# Altium project theremin.PrjPcb
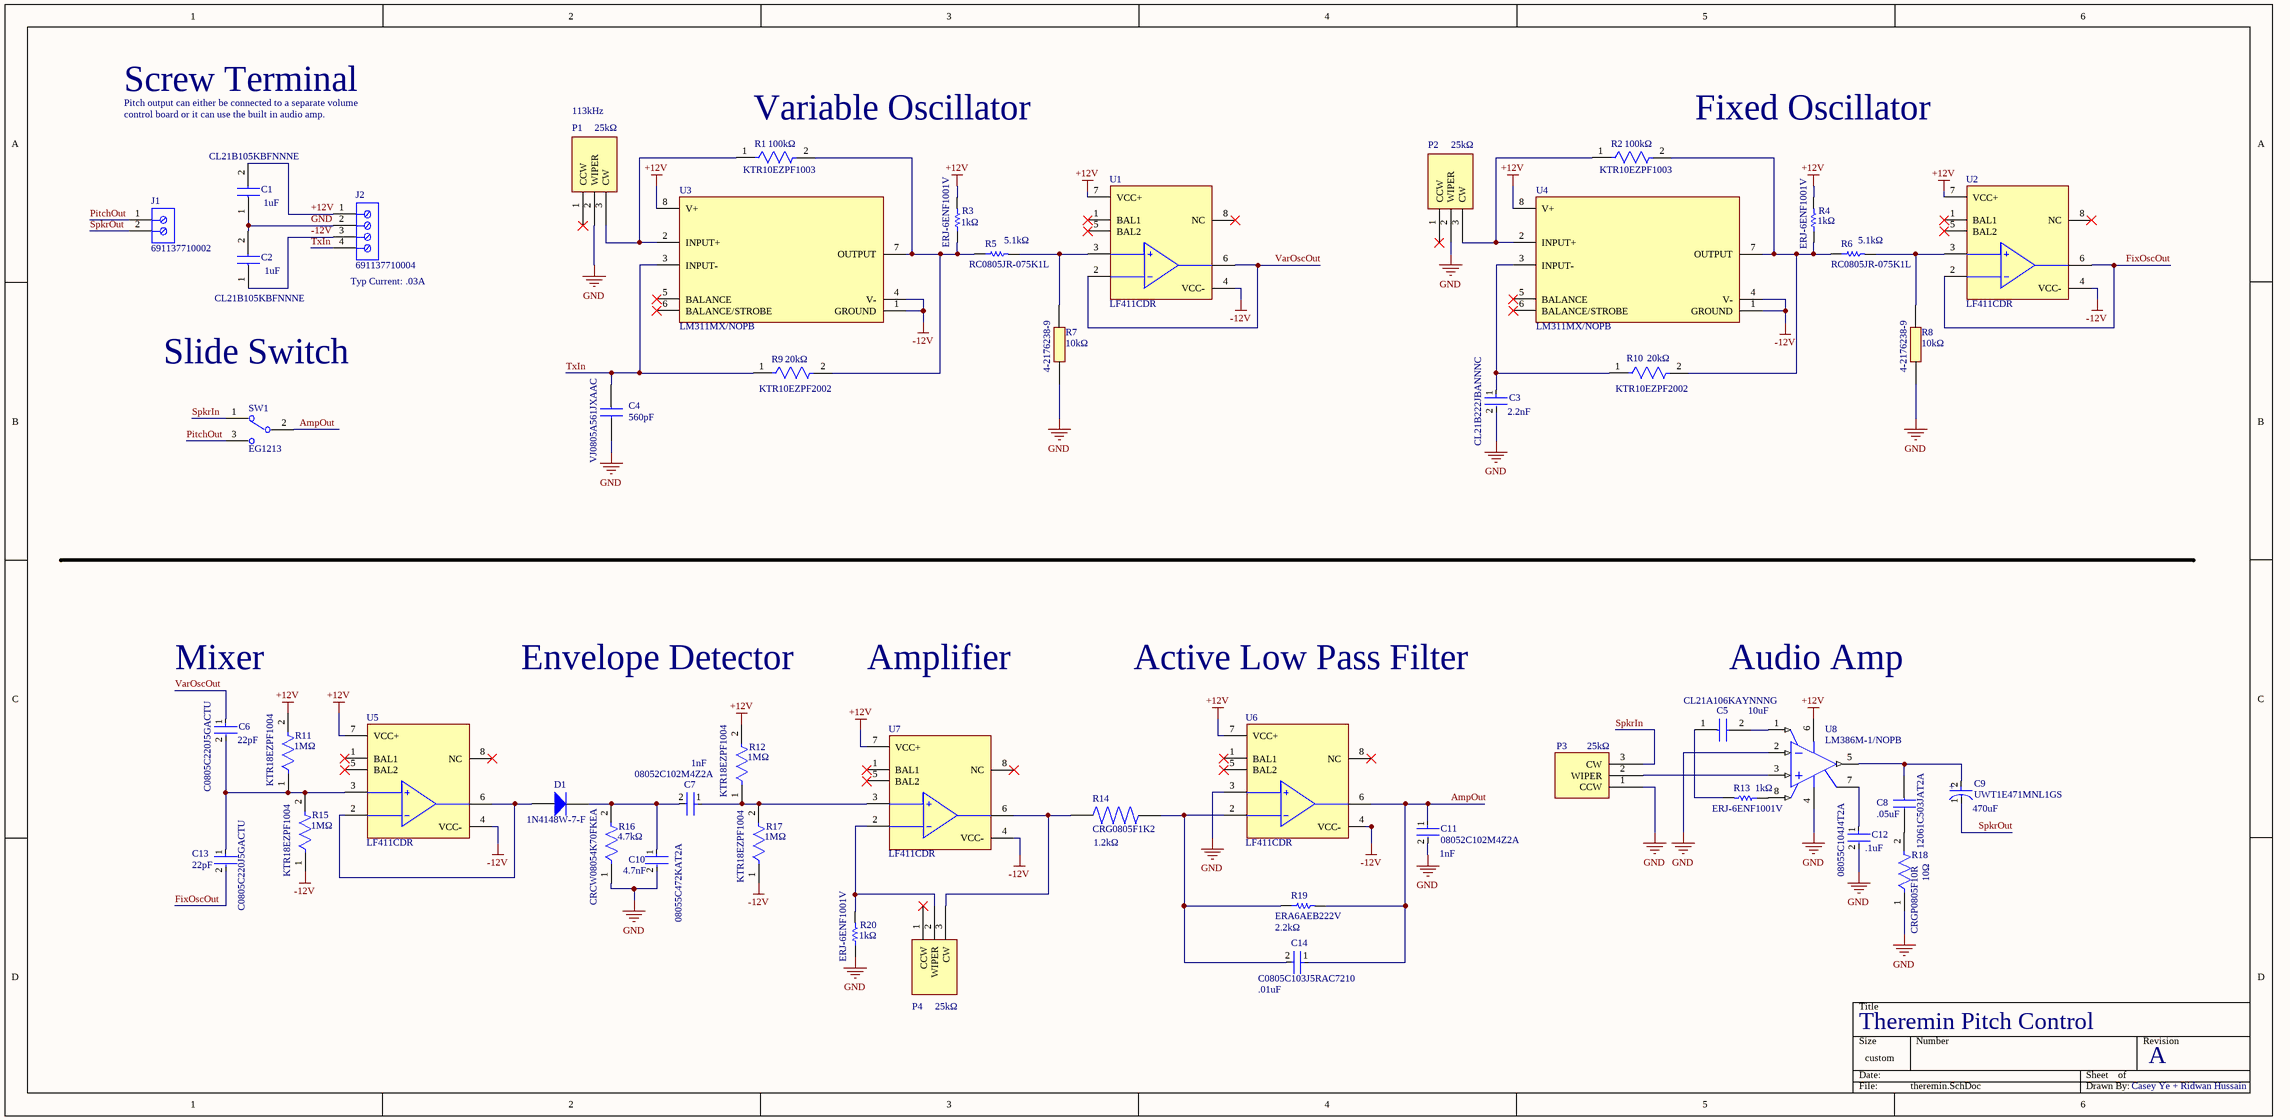
[diagram p0: theremin.SchDoc]
1 sheet, 50 parts. Net scope: global (net labels, ports and power ports of the same name join across sheets).
Board files: theremin.PcbDoc, theremin2.PcbDoc

## Sheet theremin.SchDoc
size 508 x 248 mm

### Parts
C1  CL21B105KBFNNNE  [CAPC2012X135N]
C2  CL21B105KBFNNNE  [CAPC2012X135N]
C3  CL21B222JBANNNC  [FP-CL21-IPC_B]
C4  VJ0805A561JXAAC  [CAPC2012X145N]
C5  CL21A106KAYNNNG  [CAPC2012X145N]
C6  C0805C220J5GACTU  [FP-C0805C-DN-MFG]
C7  08052C102M4Z2A  [FP-0805-L_2_01_0_2-W_1_25-IPC_B]
C8  12061C503JAT2A  [CAPC3216X94N]  (value not drawn)
C9  UWT1E471MNL1GS  [FP-UWT1E471MNL1GS-MFG]
C10  08055C472KAT2A  [FP-0805-L_2_01_0_2-W_1_25-IPC_B]
C11  08052C102M4Z2A  [FP-0805-L_2_01_0_2-W_1_25-IPC_B]
C12  08055C104J4T2A  [FP-0805-L_2_01_0_2-W_1_25-MFG]
C13  C0805C220J5GACTU  [FP-C0805C-DN-MFG]
C14  C0805C103J5RAC7210  [FP-C0805C-DN-MFG]
D1  1N4148W-7-F  [DIOD-SOD123-2_V]
J1  691137710002  [691137710002]
J2  691137710004  [691137710004]
P1  25kOhmPotentiometer  [25kOhmPotentiometer-Footprint-1]  (value not drawn)
P2  25kOhmPotentiometer  [25kOhmPotentiometer-Footprint-1]  (value not drawn)
P3  25kOhmPotentiometer  [25kOhmPotentiometer-Footprint-1]  (value not drawn)
P4  25kOhmPotentiometer  [25kOhmPotentiometer-Footprint-1]  (value not drawn)
R1  KTR10EZPF1003  [FP-KTR10-MFG]
R2  KTR10EZPF1003  [FP-KTR10-MFG]
R3  ERJ-6ENF1001V  [RESC2013X70X40ML20T20]
R4  ERJ-6ENF1001V  [RESC2013X70X40ML20T20]
R5  RC0805JR-075K1L  [RESC2013X60X35ML10T20]
R6  RC0805JR-075K1L  [RESC2013X60X35ML10T20]
R7  4-2176238-9  [RESC2012X65N]
R8  4-2176238-9  [RESC2012X65N]
R9  KTR10EZPF2002  [FP-KTR10-IPC_C]
R10  KTR10EZPF2002  [FP-KTR10-IPC_C]
R11  KTR18EZPF1004  [FP-KTR18-IPC_C]
R12  KTR18EZPF1004  [FP-KTR18-IPC_C]
R13  ERJ-6ENF1001V  [RESC2013X70X40ML20T20]
R14  CRG0805F1K2  [RESC2012X65N]
R15  KTR18EZPF1004  [FP-KTR18-IPC_C]
R16  CRCW08054K70FKEA  [FP-CRCW0805-e3-IPC_B]
R17  KTR18EZPF1004  [FP-KTR18-IPC_C]
R18  CRGP0805F10R  [FP-CRGP0805-IPC_C]
R19  ERA6AEB222V  [RESC2013X60X40LL20T25]
R20  ERJ-6ENF1001V  [RESC2013X70X40ML20T20]
SW1  EG1213  [SW_EG1213]
U1  LF411CDR  [FP-D0008A-IPC_A]
U2  LF411CDR  [FP-D0008A-IPC_A]
U3  LM311MX/NOPB  [FP-D0008A-IPC_A]
U4  LM311MX/NOPB  [FP-D0008A-IPC_A]
U5  LF411CDR  [FP-D0008A-IPC_A]
U6  LF411CDR  [FP-D0008A-IPC_A]
U7  LF411CDR  [FP-D0008A-IPC_A]
U8  LM386M-1/NOPB  [TI-D8_M]

### Nets
+12V: C1.2 J2.1 R3.2 R4.2 R11.2 R12.2 U1.7(VCC+) U2.7(VCC+) U3.8(V+) U4.8(V+) U5.7(VCC+) U6.7(VCC+) U7.7(VCC+) U8.6(VS)
-12V: C2.1 J2.3 R15.1 R17.1 U1.4(VCC-) U2.4(VCC-) U3.1(GROUND) U3.4(V-) U4.1(GROUND) U4.4(V-) U5.4(VCC-) U6.4(VCC-) U7.4(VCC-)
GND: C1.1 C2.2 C3.2 C4.1 C10.2 C11.2 C12.2 J2.2 P1.2(WIPER) P2.2(WIPER) P3.1(CCW) R7.1 R8.1 R16.1 R18.1 R20.1 U6.3(IN+) U8.2(IN-) U8.4(GND)
AmpOut: C11.1 C14.1 R19.2 SW1.2 U6.6(OUT)
FixOscOut: C13.2 U2.2(IN-) U2.6(OUT)
PitchOut: J1.1 SW1.3
SpkrIn: P3.3(CW) SW1.1
SpkrOut: C9.1(C) J1.2
TxIn: C4.2 J2.4 R9.1 U3.3(INPUT-)
VarOscOut: C6.1 U1.2(IN-) U1.6(OUT)
NetC3_1: C3.1 R10.1 U4.3(INPUT-)
NetC5_1: C5.1 R13.2
NetC5_2: C5.2 U8.1(GAIN)
NetC6_2: C6.2 C13.1 R11.1 R15.2 U5.3(IN+)
NetC7_1: C7.1 R12.1 R17.2 U7.3(IN+)
NetC7_2: C7.2 C10.1 D1.2(K) R16.2
NetC8_1: C8.1 R18.2
NetC8_2: C8.2 C9.2(A) U8.5(VOUT)
NetC12_1: C12.1 U8.7(BYPASS)
NetC14_2: C14.2 R14.2 R19.1 U6.2(IN-)
NetD1_1: D1.1(A) U5.2(IN-) U5.6(OUT)
NetP1_3: P1.3(CW) R1.1 U3.2(INPUT+)
NetP2_3: P2.3(CW) R2.1 U4.2(INPUT+)
NetP3_2: P3.2(WIPER) U8.3(IN+)
NetP4_2: P4.2(WIPER) R20.2 U7.2(IN-)
NetP4_3: P4.3(CW) R14.1 U7.6(OUT)
NetR1_2: R1.2 R3.1 R5.1 R9.2 U3.7(OUTPUT)
NetR2_2: R2.2 R4.1 R6.1 R10.2 U4.7(OUTPUT)
NetR5_2: R5.2 R7.2 U1.3(IN+)
NetR6_2: R6.2 R8.2 U2.3(IN+)
NetR13_1: R13.1 U8.8(GAIN)

Not connected (* = marked no-connect by the designer): P1 1(CCW)*; P2 1(CCW)*; P4 1(CCW)*; U1 1(BAL1)* 5(BAL2)* 8(NC)*; U2 1(BAL1)* 5(BAL2)* 8(NC)*; U3 5(BALANCE)* 6(BALANCE/STROBE)*; U4 5(BALANCE)* 6(BALANCE/STROBE)*; U5 1(BAL1)* 5(BAL2)* 8(NC)*; U6 1(BAL1)* 5(BAL2)* 8(NC)*; U7 1(BAL1)* 5(BAL2)* 8(NC)*

### Notes on the sheet
- Screw Terminal
- 113kHz
- Pitch output can either be connected to a separate volume control board or it can use the built in audio amp.
- 25kΩ
- (near R1) Variable Oscillator
- (near R1) 100kΩ
- (near R2) 100kΩ
- Fixed Oscillator
- (near C1) 1uF
- (near R3) 1kΩ
- (near R4) 1kΩ
- (near C2) 1uF
- (near J2) Typ Current: .03A
- (near R5) 5.1kΩ
- (near R6) 5.1kΩ
- (near R7) 10kΩ
- (near R8) 10kΩ
- Slide Switch
- (near R9) 20kΩ
- (near R10) 20kΩ
- (near C4) 560pF
- (near C3) 2.2nF
- Mixer
- Envelope Detector
- Amplifier
- Active Low Pass Filter
- Audio Amp
- 10uF
- (near C6) 22pF
- (near R11) 1MΩ
- 1nF
- (near R12) 1MΩ
- (near P3) 25kΩ
- (near R13) 1kΩ
- (near R15) 1MΩ
- (near R16) 4.7kΩ
- (near R17) 1MΩ
- (near R14) 1.2kΩ
- (near C12) .1uF
- (near C8) .05uF
- 12061C503JAT2A
- (near C9) 470uF
- (near C13) 22pF
- 4.7nF
- (near C11) 1nF
- (near R18) 10Ω
- (near R20) 1kΩ
- 2.2kΩ
- (near C14) .01uF
- Theremin Pitch Control
- A
- Casey Ye + Ridwan Hussain
- (in symbol CMP-12462-000037-1) +

### Library data of the parts
C1 C2 = CL21B105KBFNNNE: Capacitor; Manufacturer_Name: SAMSUNG; Datasheet Link: https://componentsearchengine.com/Datasheets/2/CL21B105KBFNNNE.pdf; Height: 1.35mm; Manufacturer_Part_Number: CL21B105KBFNNNE; Mouser Part Number: 187-CL21B105KBFNNNE; Mouser Price/Stock: https://www.mouser.co.uk/ProductDetail/Samsung-Electro-Mechanics/CL21B105KBFNNNE?qs=yOVawPpwOwmddQEBPU6Y9A%3D%3D; Arrow Part Number: CL21B105KBFNNNE; Arrow Price/Stock: https://www.arrow.com/en/products/cl21b105kbfnnne/samsung-electro-mechanics?region=europe
C3 = CMP-13271-000077-1: CL21 Series 0805 2.2nF 50V ±5% Tolerance X7R Multilayer Ceramic Chip Capacitor; Voltage Rating: 50V; Case/Package: 0805; Voltage Rating (DC): 50V; Dielectric: X7R; Lead Free: Lead Free; Max Operating Temperature: 125°C; Width: 0.049inch; Case Code (Imperial): 0805; Case Code (Metric): 2012; Tolerance: 5%; Length: 2mm; Mount: Surface Mount; Contact Plating: Tin; Voltage: 50V; Height: 0.65mm; Package Quantity: 4000; Thickness: 0.03inch; Depth: 1.25mm; Min Operating Temperature: -55°C; Radiation Hardening: No; Capacitance: 2.2nF; Packaging: Tape and Reel
C4 = CMP-030-000000-1: VISHAY - VJ0805A561JXAAC - CAP, 560PF, 50V, 5%, C0G/NP0, 0805; Geometry.Height: 1.45mm; Manufacturer_Name: Vishay; Source: VJ0805A561JXAAC.SchLib; Mouser Part Number: 77-VJ0805A561JXAAC; Design Item ID: VJ0805A561JXAAC; Datasheet Link: http://www.vishay.com/docs/45226/vj31xrohsautomlcc.pdf; Mouser Price/Stock: https://www.mouser.co.uk/ProductDetail/Vishay-Vitramon/VJ0805A561JXAAC?qs=ReTA%2F0kwlVYgsqJl6lJxLg%3D%3D; Manufacturer_Part_Number: VJ0805A561JXAAC
C5 = CL21A106KAYNNNG: Capacitor; Manufacturer_Name: SAMSUNG; Datasheet Link: https://www.arrow.com/en/products/cl21a106kaynnng/samsung-electro-mechanics; Height: 1.45mm; Manufacturer_Part_Number: CL21A106KAYNNNG; Mouser Part Number: 187-CL21A106KAYNNNG; Mouser Price/Stock: https://www.mouser.co.uk/ProductDetail/Samsung-Electro-Mechanics/CL21A106KAYNNNG?qs=yOVawPpwOwl2HL%252Buj2PlNg%3D%3D; Arrow Part Number: CL21A106KAYNNNG; Arrow Price/Stock: https://www.arrow.com/en/products/cl21a106kaynnng/samsung-electro-mechanics?region=nac
C6 C13 = CMP-2007-00048-2: Capacitor; Ceramic; Cap; 22.0pF; Tol 5%; SMT; Vol-Rtg 50V; C0G; Tape and Reel; Manufacturer: KEMET; Temperature Coefficient: 30ppm/°C; Capacitance: 22 pF; Value: 22 pF; Tolerance: 0.05; Device Class L1: Passive Components; Mouser Description: Multilayer Ceramic Capacitors MLCC - SMD/SMT 50volts 22pF C0G 5%; Temperature Range Low: -55°C; Automotive: No; Voltage Rating: 50 V; Material: Ceramic; Category: Cap; Height: 0.88mm; Temperature Range High: +125°C; Digikey Description: Capacitor; Ceramic; Cap; 22.0pF; Tol 5%; SMT; Vol-Rtg 50V; C0G; Tape and Reel; Octopart: https://octopart.com/c0805c220j5gactu-kemet-145470; ComponentLink2Description: Datasheet; Device Class L2: Capacitors; Ipc Land Pattern Name: CAPC200125X78; RoHS: TRUE; ComponentLink2URL: https://content.kemet.com/datasheets/KEM_C1003_C0G_SMD.pdf; Temperature: -55°C to +125°C; Device Class L3: Ceramic Capacitors; Lead Free: Yes; Manufacturer Part Number: C0805C220J5GACTU; Temperature Characteristic: C0G; Package: C0805C-DN
C7 C11 = CMP-04427-001942-1: Automotive Ceramic Capacitor, 0805, 1nF, 20%, X7R, 0.15, 200V; Thickness: 0.037inch; Capacitance: 1nF; Dielectric: X7R; Ratings: AEC-Q200; Min Operating Temperature: -55°C; Case/Package: 0805; Tolerance: 20%; Voltage Rating: 200V; Mount: Surface Mount; Voltage Rating (DC): 200V; Max Operating Temperature: 125°C; Length: 0.079inch; Width: 0.049inch; Packaging: Tape and Reel; Depth: 1.25mm; RoHS Compliant: Yes; Features: Soft Termination
C8 = CMP-012-000000-1: Multilayer Ceramic Capacitors MLCC - SMD/SMT 100V .05uF X7R 1206 5% Tol; Manufacturer_Name: Kyocera AVX; Geometry.Height: 0.94mm; Design Item ID: 12061C503JAT2A; Source: 12061C503JAT2A.SchLib; Mouser Part Number: 581-12061C503JAT2A; Datasheet Link: http://datasheets.avx.com/X7RDielectric.pdf; Mouser Price/Stock: https://www.mouser.co.uk/ProductDetail/KYOCERA-AVX/12061C503JAT2A?qs=9g9l2Gjnh0tpSIGc6XCvtQ%3D%3D; Manufacturer_Part_Number: 12061C503JAT2A
C9 = CMP-12462-000037-1: CAP ALUM 470UF 20% 25V SMD; Leakage Current: 3uA; Dielectric Material: Aluminium; Ripple Current: 300mA; Life (Hours): 1000Hour; Lead Diameter: 1.1mm; Dissipation Factor: 0.16%; Min Operating Temperature: -55°C; Height - Seated (Max): 0.394inch; REACH SVHC: No SVHC; Radiation Hardening: No; Capacitance: 470uF; Lead Free: Lead Free; Voltage: 25V; Length: 10mm; Mount: Surface Mount; Package Quantity: 500; Height: 10mm; Lead Pitch: 4.5mm; Series: WT; Max Operating Temperature: 105°C; Number of Pins: 2; Voltage Rating: 25V; RoHS Compliant: Yes; Construction: Cylindrical; Voltage Rating (DC): 25V; Packaging: Tape and Reel; Ripple Current (AC): 300mA; Tolerance: 20%; Termination: SMD/SMT; Case/Package: Radial; Diameter: 10mm
C10 = CMP-1036-03594-3: General Purpose Ceramic Capacitor, 0805, 4.7nF, 10%, X7R, 0.15, 50V; Dissipation Factor: 2.5%; Insulation Resistance: 100GR; Depth: 1.25mm; Width: 1.25mm; Construction: Flat; Series: -; Termination: SMD/SMT; Case Code (Imperial): 0805; Voltage Rating: 50V; Number of Pins: 2; Voltage Rating (DC): 50V; Dielectric Material: Ceramic; Capacitance: 4.7nF; Thickness: 0.037inch; Package Quantity: 1; Mount: Surface Mount; Voltage: 50V; Min Operating Temperature: -55°C; Size: 0.94mm; Packaging: Tape and Reel; Dielectric: X7R; RoHS Compliant: Yes; REACH SVHC: No SVHC; Tolerance: 10%; Length: 2.01mm; Lead Free: Lead Free; Radiation Hardening: No; Case/Package: 0805; Case Code (Metric): 2012; Max Operating Temperature: 125°C; Height: 0.94mm; Contact Plating: Tin
C12 = CMP-2007-04725-2: Automotive Ceramic Capacitor, 0805, 100nF, 5%, X7R, 15%, 50V; Dissipation Factor: 2.5%; Construction: Flat; Length: 2.01mm; Series: -; Tolerance: 5%; Number of Pins: 2; Termination: SMD/SMT; Packaging: Tape and Reel; Case/Package: 0805; Mount: Surface Mount; Depth: 1.25mm; Voltage Rating (DC): 50V; Package Quantity: 4000; RoHS Compliant: Yes; Ratings: AEC-Q200; Voltage Rating: 50V; Contact Plating: Tin; Width: 0.049inch; Height: 0.94mm; Dielectric: X7R; Case Code (Metric): 2012; Min Operating Temperature: -55°C; Lead Free: Lead Free; Radiation Hardening: No; Capacitance: 100nF; Thickness: 0.037inch; Max Operating Temperature: 125°C; Case Code (Imperial): 0805
C14 = CMP-2007-01173-3: CAP CER SMD 0805 .01UF X7R 5% 50; Manufacturer: KEMET; Value: 10,000 pF; Temperature Coefficient: 30ppm/°C; Tolerance: 0.05; Voltage Rating: 50 V; Material: Ceramic; Digikey Description: CAP CER SMD 0805 .01UF X7R 5% 50; Temperature Characteristic: X7R; Manufacturer Part Number: C0805C103J5RAC7210; ComponentLink2URL: https://content.kemet.com/datasheets/KEM_C1003_C0G_SMD.pdf; ComponentLink2Description: Datasheet; Temperature Range High: +125°C; Package: C0805C-DN; Category: Cap; RoHS: TRUE; Device Class L1: Passive Components; Ipc Land Pattern Name: CAPC200125X78; Mouser Description: Cap Ceramic 0.01uF 50V X7R 5% Pad SMD 0805 125C T/R; Temperature: -55°C to +125°C; Octopart: https://octopart.com/c0805c103j5rac7210-kemet-3921106; Capacitance: 10,000 pF; Height: 0.88mm; Temperature Range Low: -55°C; Device Class L3: Ceramic Capacitors; Device Class L2: Capacitors; Lead Free: Yes; Automotive: No
D1 = CMP-2000-04932-2: Fast Switching Diode, 100 V, 0.15 A, -65 to 150 degC, 2-Pin?SOD123, RoHS, Tape and Reel; Recovery Time: 4ns; Brand: DiodesIncorporated; Unit Weight: 0.000353oz; Max Surge Current: 2A; Peak Reverse Voltage: 100V; Ir - Reverse Current: 1uA; Vf - Forward Voltage: 1.25V; Configuration: Single; If - Forward Current: 0.15A; Product Category: Diodes-GeneralPurpose,Power,Switching; Operating Temperature Range: -65Cto+150C; Packaging: Reel; Manufacturer URL: http://www.diodes.com/; Maximum Operating Temperature: +150C; Height: 1.25mm; Minimum Operating Temperature: -65C; Product: SwitchingDiodes; Package URL: http://www.diodes.com/datasheets/ds18004.pdf; Type: SwitchingDiode; Package Reference: SOD123-2; Width: 1.7mm; Datasheet URL: http://www.farnell.com/datasheets/1915529.pdf; Datasheet Version: Rev. 24-2, 10/2013; Series: 1N4148; Factory Pack Quantity: 3000; Length: 2.85mm; RoHS: True; Manufacturer: DiodesIncorporated; Mounting Style: SMD/SMT; Package / Case: SOD-123
J1 = CMP-1502-03324-2: NexarPartId: 78871135; Voltage Rating: 300V; Number of Contacts: 2; Current Rating: 16A; Lead Pitch: 5mm; Height: 11.6mm; Packaging: Box; RoHS: Non-Compliant; Contact Material: Nickel, Tin; Max Operating Temperature: 120°C; Number of Pins: 2; Min Operating Temperature: -30°C; Number of Rows: 1
J2 = CMP-1502-03326-2: NexarPartId: 78871140; Packaging: Box; RoHS: Non-Compliant; Number of Pins: 4; Lead Pitch: 5mm
P1 = CMP-009-00188-4: 25k Ohm Potentiometer
P2-P4 = CMP-009-00188-3: 25k Ohm Potentiometer
R1 R2 = CMP-08839-031120-1: Res Thick Film 0805 100kΩ 1% 0.125W ±100ppm/°C Automotive Paper T/R; Resistance: 100kR; Max Power Dissipation: 125mW; Resistor Type: Thick Film; RoHS Compliant: Yes; Case Code (Metric): 2012; Case/Package: 0805; Number of Terminations: 2; Min Operating Temperature: -55°C; Features: Automotive AEC-Q200; Contact Plating: Tin; Max Operating Temperature: 155°C; Tolerance: 1%; Packaging: Tape and Reel; Case Code (Imperial): 0805; Series: KTR; Temperature Coefficient: 100ppm/°C
R3 R4 R13 R20 = CMP-2001-04375-5: Chip Resistor, 1 KOhm, +/- 1%, 0.125 W, -55 to 155 degC, 0805 (2012 Metric), RoHS, Tape and Reel; Manufacturer: Panasonic; Voltage Rating: 150 V; ComponentLink1URL: http://www.panasonic.com/; ComponentLink2Description: Datasheet; REACH SVHC: Yes; ComponentLink1Description: Manufacturer URL; Length: 2 mm; Height: 0.6 mm; Package Quantity: 1; PackageDescription: 2-Pin Surface Mount Device, Body 2 x 1.25 mm; Packaging: Cut Tape; PackageReference: 0805; Max Operating Temperature: 155 degC; Mounting Technology: Surface Mount; ComponentLink2URL: http://industrial.panasonic.com/cdbs/www-data/pdf/RDA0000/AOA0000C86.pdf; DatasheetVersion: 04/2015; Min Operating Temperature: -55 degC; RoHSCompliant: true; Mount: Surface Mount
R5 R6 = CMP-2001-01390-1: Manufacturer: Yageo; Part Number: RC0805JR-075K1L
R7 R8 = CMP-045-000000-3: Thin Film Resistors - SMD CPF A 0805 10K 0.1% 25PPM 5K RL; Manufacturer_Name: TE Connectivity; Geometry.Height: 0.65mm; Datasheet Link: https://www.te.com/commerce/DocumentDelivery/DDEController?Action=srchrtrv&DocNm=1773200-1&DocType=Data%20Sheet&DocLang=English&DocFormat=pdf&PartCntxt=4-2176238-9; Mouser Part Number: *; Source: 4-2176238-9.SchLib; Design Item ID: 4-2176238-9; Manufacturer_Part_Number: 4-2176238-9; Mouser Price/Stock: *
R9 R10 = CMP-08839-031312-1: Res Thick Film 0805 20kΩ 1% 0.125W ±100ppm/°C Automotive Paper T/R; Resistance: 20kR; Max Power Dissipation: 125mW; Case/Package: 0805; Min Operating Temperature: -55°C; Resistor Type: Thick Film; Max Operating Temperature: 155°C; RoHS Compliant: Yes; Case Code (Metric): 2012; Features: Automotive AEC-Q200; Packaging: Tape and Reel; Case Code (Imperial): 0805; Tolerance: 1%; Temperature Coefficient: 100ppm/°C; Number of Terminations: 2; Series: KTR
R11 R12 R15 R17 = CMP-08839-030004-1: Res Thick Film 1206 1MΩ 1% 0.1W ±100ppm/°C Automotive Paper T/R; Resistance: 1MR; Power Rating: 250mW; Package Quantity: 1; Mount: Surface Mount; Min Operating Temperature: -55°C; Case Code (Metric): 3216; Case Code (Imperial): 1206; Width: 0.063inch; Height: 0.026inch; Packaging: Tape and Reel; Max Operating Temperature: 155°C; Resistor Type: Thick Film; Features: Automotive AEC-Q200; Length: 0.126inch; RoHS Compliant: Yes; Tolerance: 1%; Temperature Coefficient: 100ppm/°C; Lead Free: Lead Free; Case/Package: 1206; Number of Terminations: 2; Series: KTR18; Max Power Dissipation: 250mW
R14 = CMP-100-000000-1: Fixed Resistors; MF: TE Connectivity; Tolerance: 1%; Voltage_Rating: 150 V; Power_Rating: .125 W; Resistance: 1.2K; EU_RoHS_Compliance: Compliant with Exemptions; Availability: Unavailable; Design Item ID: CRG0805F1K2; TE_purchase_URL: https://www.te.com/usa-en/product-1623133-1.html?te_bu=Cor&te_type=disp&te_campaign=seda_glo_cor-seda-global-disp-prtnr-fy19-seda-model-bom-cta_sma-317_1&elqCampaignId=32493; SnapEDA_Link: https://www.snapeda.com/parts/CRG0805F1K2/TE%20Connectivity/view-part/979062/?ref=snap; Value: *; Component Type: Standard; MP: CRG0805F1K2; Price: None; Package: 0805; Source: SnapEDAsch.SchLib; Pin Count: 2
R16 = CMP-2100-03615-2: RES Thick Film, 4.7kΩ, 1%, 0.125W, 100ppm/°C, 0805; Max Power Dissipation: 125mW; Resistance: 4.7kR; Voltage Rating: 150V; Termination: SMD/SMT; Weight: 0.000194oz; Case/Package: 0805; Number of Terminations: 2; Min Operating Temperature: -55°C; Case Code (Metric): 2012; Package Quantity: 10; Depth: 1.25mm; Military Standard: Not; Composition: Thick Film; Radiation Hardening: No; Contact Plating: Tin; Height: 0.45mm; Power Rating: 125mW; Features: Automotive AEC-Q200; Tolerance: 1%; Packaging: Tape and Reel; Max Operating Temperature: 155°C; Length: 2mm; Case Code (Imperial): 0805; Voltage Rating (DC): 150V; Width: 1.25mm; Temperature Coefficient: 100ppm/°C; Lead Free: Lead Free
R18 = CMP-03211-010199-1: CRGP 0805 10R 1%; Manufacturer: TE; Voltage Rating: 150V; Resistance: 10Ω; Tolerance: 0.01; Power Rating: 0.33W; Temperature Coefficient: ±100ppm/°C; Value: 10Ω; Temperature Range Low: -55°C; Height: 0.65mm; Lead Free: Yes; RoHS: TRUE; Device Class L2: Resistors; Manufacturer Part Number: CRGP0805F10R; ComponentLink2Description: Datasheet; Device Class L1: Passive Components; Ipc Land Pattern Name: RESC200125X55; Category: Res; Temperature Range High: +155°C; Package: CRGP0805; Ambient Temperature Range High: +70°C; Series: CRGP; Digikey Description: CRGP 0805 10R 1%; Octopart: https://octopart.com/crgp0805f10r-te+connectivity-91018783; Composition: Thick Film; Temperature: -55°C to +155°C; ComponentLink2URL: https://www.mouser.com/datasheet/2/418/NG_DS_9-1773463-9_A-1358566.pdf; Automotive: No; Device Class L3: Chip SMD Resistors
R19 = CMP-2001-00613-1: Manufacturer: Panasonic; Part Number: ERA6AEB222V
SW1 = CMP-102-000000-1: <b>EG Series SPDT On-On Right Angle Through Hole Slide Switch</b>; Pin Count: 3; Source: EG1213.SchLib; Design Item ID: EG1213; Package: None; Component Type: Standard; Value: *; Price: None; MP: EG1213; Availability: Unavailable
U1 U2 U5-U7 = CMP-04895-000362-1: IC OPAMP JFET 1 CIRCUIT 8SOIC; Input Voltage Noise Density: 18nV/sqrt Hz; Min Dual Supply Voltage: 3.5V; Operating Supply Current: 2mA; Input Noise Current Density: 0.01pA/sqrt Hz; Dual Supply Voltage: 15V; Input Bias Current: 200pA; Bandwidth: 3MHz; Voltage Gain: 106.02dB; Operating Supply Voltage: 18V; Max Power Dissipation: 500mW; Number of Circuits: 1; Nominal Supply Current: 3.4mA; Supply Type: Dual; Common Mode Rejection Ratio: 100dB; Slew Rate: 15V/µs; Min Supply Voltage: 7V; Max Supply Voltage: 36V; Input Offset Voltage (Vos): 2mV; Height: 1.58mm; Width: 3.91mm; Length: 4.9mm; Lead Free: Lead Free; Contact Plating: Gold; Case/Package: SOIC; Max Operating Temperature: 70°C; Radiation Hardening: No; Weight: 0.002561oz; Mount: Surface Mount; RoHS Compliant: Yes; Series: LF411; Unity Gain Bandwidth Product: 3MHz; Packaging: Cut Tape; Number of Channels: 1; Technology: BIFET; Max Dual Supply Voltage: 18V; Min Operating Temperature: 0°C; Number of Pins: 8; Package Quantity: 2500; Gain Bandwidth Product: 3MHz; Number of Elements: 1
U3 U4 = CMP-04896-000087-1: IC VOLTAGE COMPARATOR 8-SOIC; Max Supply Current: 7.5mA; Response Time: 200ns; Power Dissipation: 500mW; Input Bias Current: 250nA; Output Current: 50mA; Output Compatibility: TTL; Max Supply Voltage: 36V; Voltage Gain: 106.02dB; Max Dual Supply Voltage: 18V; Input Offset Voltage (Vos): 7.5mV; Min Dual Supply Voltage: 2.5V; Number of Elements: 1; Min Supply Voltage: 5V; Series: -; Technology: BIPOLAR; Package Quantity: 1; Supply Current: 7.5mA; Type: General Purpose; Nominal Supply Current: 7.5mA; Max Input Current: 250nA; REACH SVHC: No SVHC; Case/Package: SOIC; Output Type: TTL; Max Power Dissipation: 500mW; Radiation Hardening: No; Lead Free: Lead Free; Max Operating Temperature: 70°C; Number of Channels: 1; Quiescent Current: 7.5mA; Number of Pins: 8; Mount: Surface Mount; Min Operating Temperature: 0°C; Packaging: Tape and Reel
U8 = CMP-0994-00001-1: Low Voltage Audio Power Amplifier, 0 to 70 degC, 8-pin SOIC (D8), Green (RoHS & no Sb/Br); Manufacturer: Texas Instruments; Input Type: Analog; SubFamily: Mid/High-Power Amplifier; Max. Number of Speaker Outputs: 1; PackageVersion: 4040047-3/M, 06/2011; ComponentLink2Description: Datasheet; DatasheetVersion: SNAS545A; ComponentLink3URL: http://www.ti.com/litv/pdf/msoi002j; ComponentLink1URL: http://www.ti.com/; Mounting Technology: Surface Mount; Eco-Plan: Green (RoHS & no Sb/Br); ComponentLink3Description: Package Specification; ComponentLink2URL: http://www.ti.com/general/docs/lit/getliterature.tsp?genericPartNumber=LM386&fileType=pdf; PartNumber: LM386M-1/NOPB; PackageDescription: 8-Pin Plastic Small Outline, Body 4.9 x 3.9 mm, Pitch 1.27 mm; ComponentLink1Description: Manufacturer URL; Code_JEDEC: MS-012; PackageReference: D8